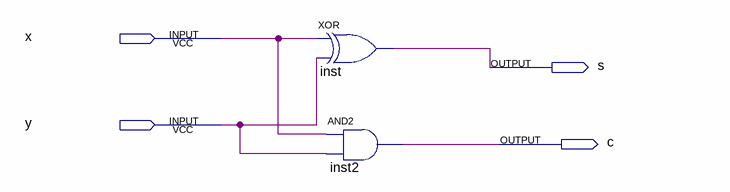
[diagram p0: schematic sheet]
// Quartus schematic half_adder.bdf as structural Verilog: 2 symbols, 4 pins
module half_adder (
  input  x,
  input  y,
  output s,
  output c
);

  xor inst (s, x, y);
  and inst2 (c, x, y);
endmodule
